# Altium schematic sheet 07 SD & QSPI & SENSOR.SchDoc
size 513 x 386 mm
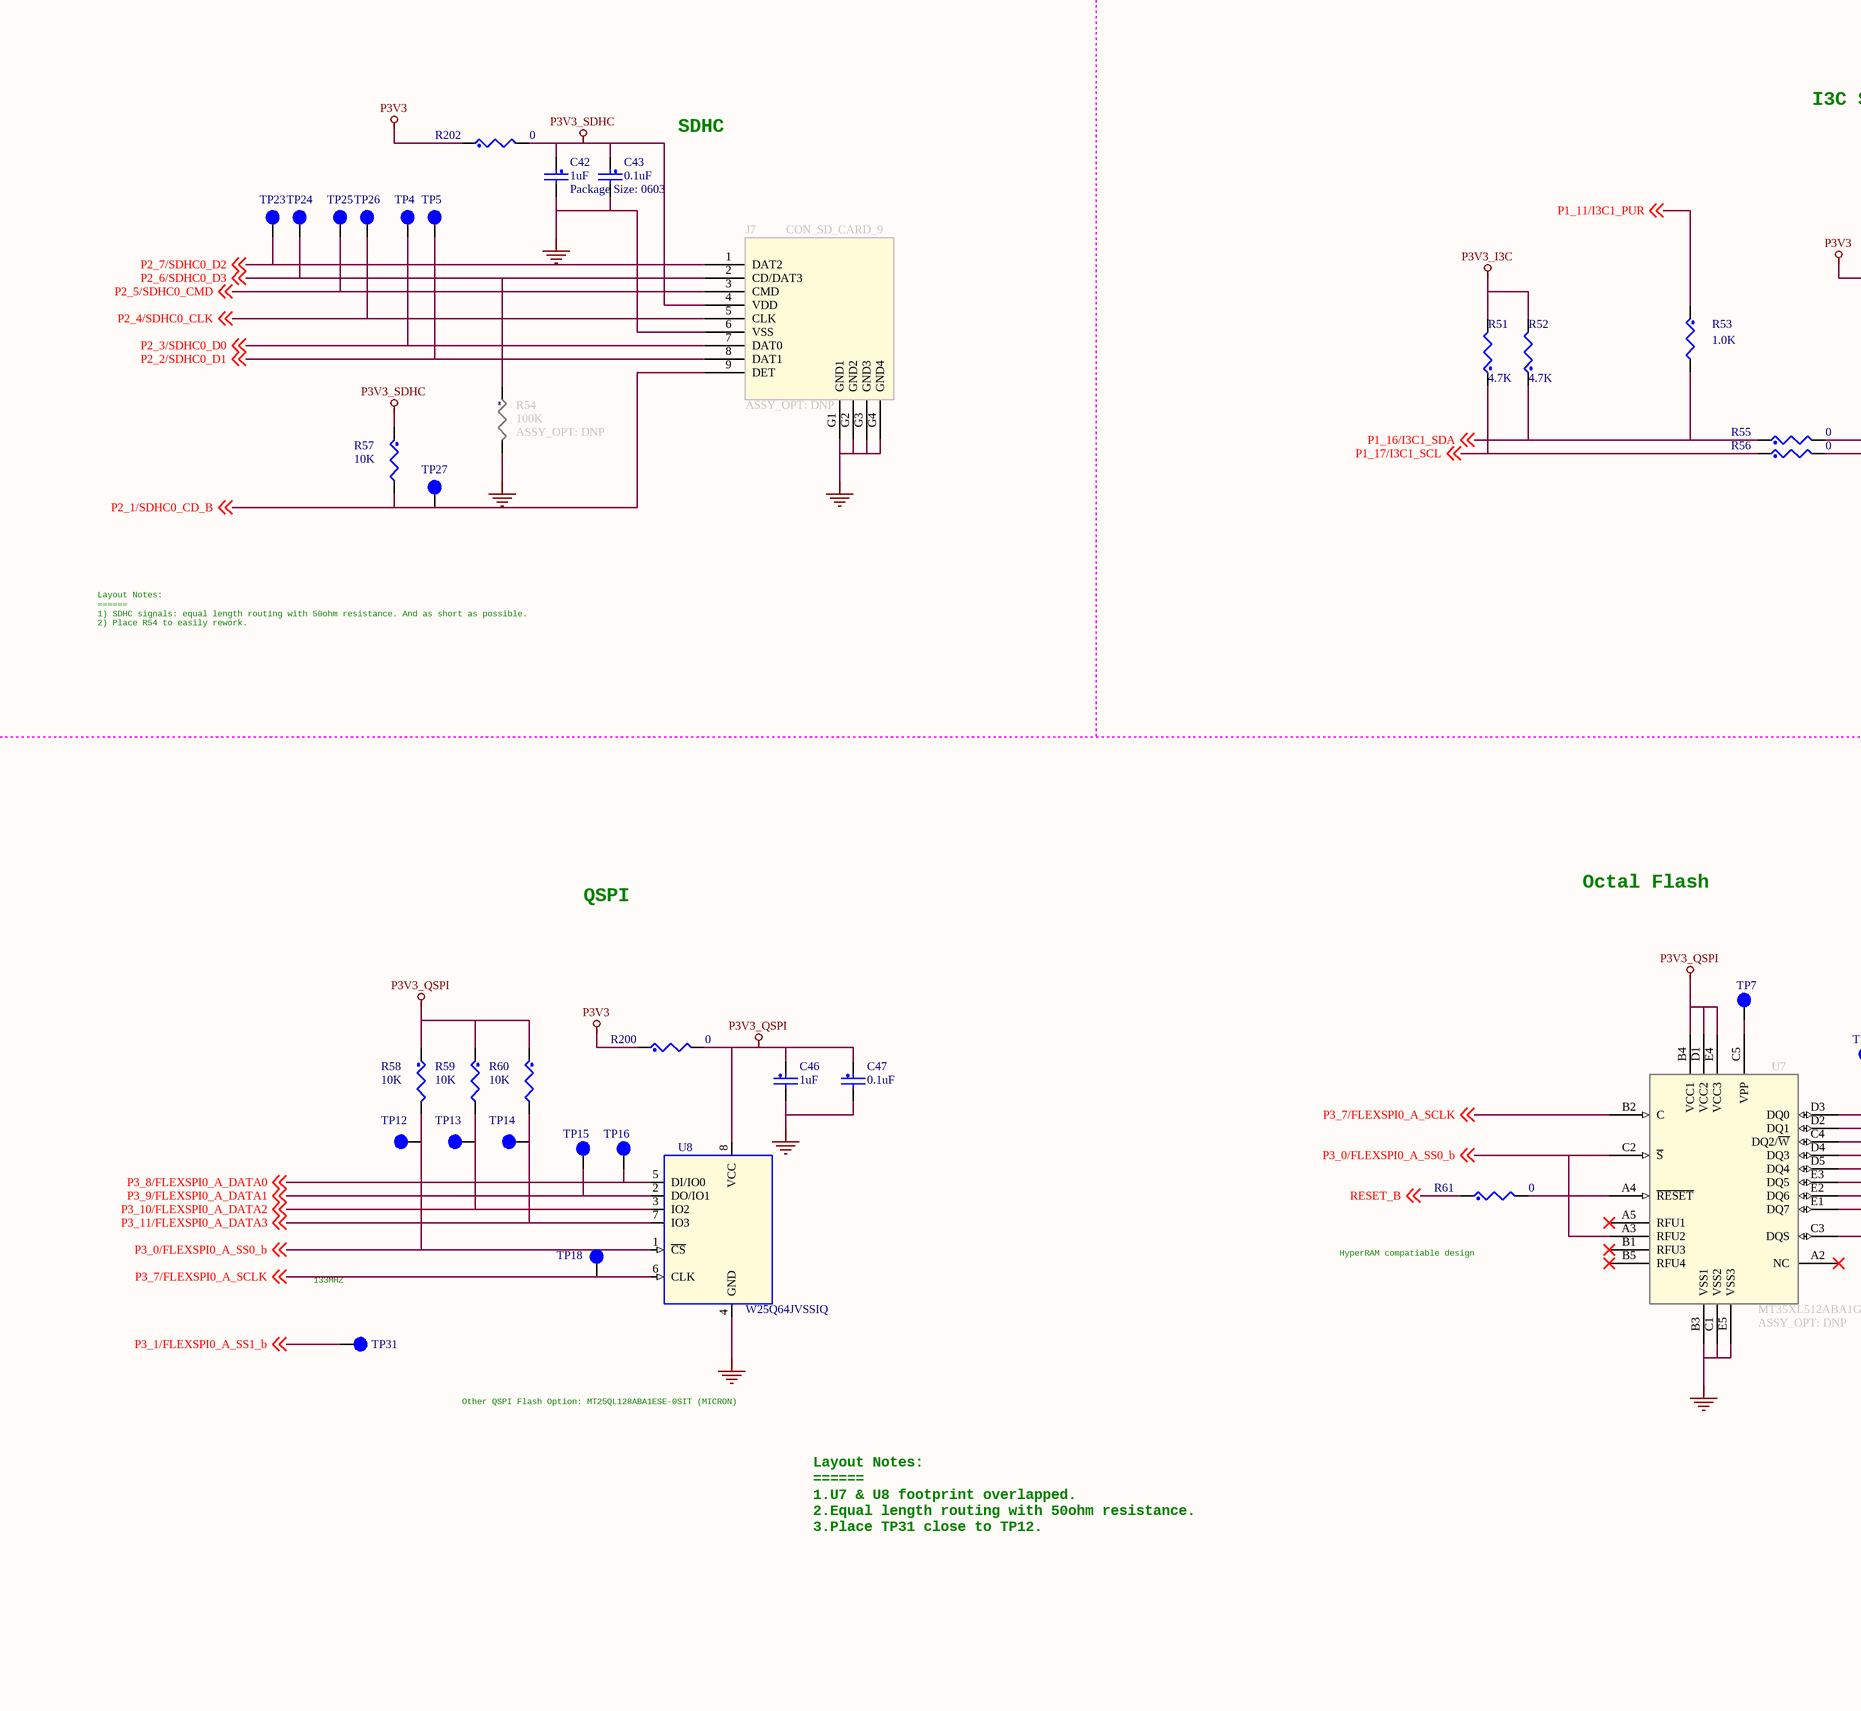
[diagram p0: 07 SD & QSPI & SENSOR.SchDoc, left]
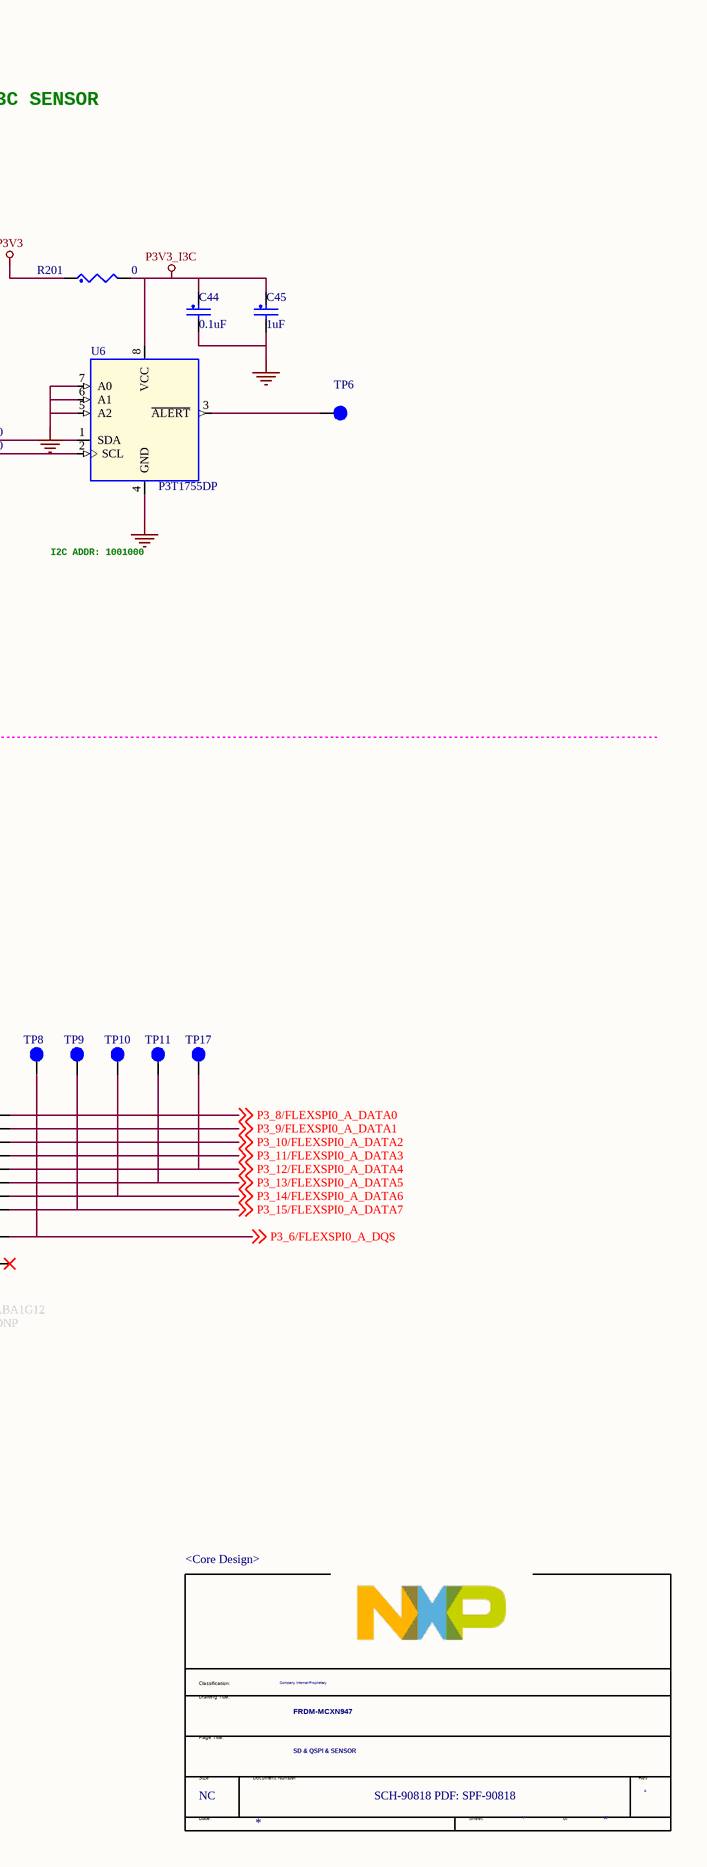
[diagram p1: 07 SD & QSPI & SENSOR.SchDoc, right]

## Parts
*  Doc: SCH-90818 PDF: SPF-90818  RevCode: A  Title: FRDM-MCXN947  Page Size: NC  Page Number: 7  Page Count: 13  PageTitle: SD & QSPI & SENSOR  Classification: Company Internal/Proprietary  Variant Name: <Core Design>  (hidden comment: TitleBlock_FS)  (graphical)
C42  1uF  Package Size: 0603  [CC0603_OV]
C43  0.1uF  [CC0402_25]
C44  0.1uF  [CC0402_25]
C45  1uF  [CC0603_OV]
C46  1uF  [CC0603_OV]
C47  0.1uF  [CC0402_25]
J7  CON_SD_CARD_9  ASSY_OPT: DNP  [con9_sdcard_1p1_15p05x14p75_sm]
R51  4.7K  [RC0402_25]
R52  4.7K  [RC0402_25]
R53  1.0K  [RC0402_25]
R54  100K  ASSY_OPT: DNP  [RC0402_25]
R55  0  [RC0603_OV]
R56  0  [RC0603_OV]
R57  10K  [RC0402_25]
R58  10K  [RC0402_25]
R59  10K  [RC0402_25]
R60  10K  [RC0402_25]
R61  0  [RC0603_OV]
R200  0  [RC0402_25]
R201  0  [RC0402_25]
R202  0  [RC0402_25]
TP4  TPAD_030  [TPAD_030]  (value not drawn)
TP5  TPAD_030  [TPAD_030]  (value not drawn)
TP6  TPAD_030  [TPAD_030]  (value not drawn)
TP7  TPAD_030  [TPAD_030]  (value not drawn)
TP8  TPAD_030  [TPAD_030]  (value not drawn)
TP9  TPAD_030  [TPAD_030]  (value not drawn)
TP10  TPAD_030  [TPAD_030]  (value not drawn)
TP11  TPAD_030  [TPAD_030]  (value not drawn)
TP12  TPAD_030  [TPAD_030]  (value not drawn)
TP13  TPAD_030  [TPAD_030]  (value not drawn)
TP14  TPAD_030  [TPAD_030]  (value not drawn)
TP15  TPAD_030  [TPAD_030]  (value not drawn)
TP16  TPAD_030  [TPAD_030]  (value not drawn)
TP17  TPAD_030  [TPAD_030]  (value not drawn)
TP18  TPAD_030  [TPAD_030]  (value not drawn)
TP23  TPAD_030  [TPAD_030]  (value not drawn)
TP24  TPAD_030  [TPAD_030]  (value not drawn)
TP25  TPAD_030  [TPAD_030]  (value not drawn)
TP26  TPAD_030  [TPAD_030]  (value not drawn)
TP27  TPAD_030  [TPAD_030]  (value not drawn)
TP31  TPAD_030  [TPAD_030]  (value not drawn)
U6  P3T1755DP  [tssop8_a]
U7  MT35XL512ABA1G12  ASSY_OPT: DNP  [pbga24_1_6x8mm]
U8  W25Q64JVSSIQ  [so8_w]

## Nets
GND: C42.2 C43.2 C44.2 C45.2 C46.2 C47.2 J7.6(VSS) J7.G1(GND1) J7.G2(GND2) J7.G3(GND3) J7.G4(GND4) R54.2 U6.4(GND) U6.5(A2) U6.6(A1) U6.7(A0) U7.B3(VSS1) U7.C1(VSS2) U7.E5(VSS3) U8.4(GND)
P3V3: R200.1 R201.1 R202.1
P3V3_I3C: C44.1 C45.1 R51.2 R52.2 R201.2 U6.8(VCC)
P3V3_QSPI: C46.1 C47.1 R58.1 R59.1 R60.1 R200.2 U7.B4(VCC1) U7.D1(VCC2) U7.E4(VCC3) U8.8(VCC)
P3V3_SDHC: C42.1 C43.1 J7.4(VDD) R57.1 R202.2
P1_11/I3C1_PUR: R53.1 ; off-sheet P1_11/I3C1_PUR
P1_16/I3C1_SDA: R52.1 R53.2 R55.1 ; off-sheet P1_16/I3C1_SDA
P1_17/I3C1_SCL: R51.1 R56.1 ; off-sheet P1_17/I3C1_SCL
P2_1/SDHC0_CD_B: J7.9(DET) R57.2 TP27.1(Pin1) ; off-sheet P2_1/SDHC0_CD_B
P2_2/SDHC0_D1: J7.8(DAT1) TP5.1(Pin1) ; off-sheet P2_2/SDHC0_D1
P2_3/SDHC0_D0: J7.7(DAT0) TP4.1(Pin1) ; off-sheet P2_3/SDHC0_D0
P2_4/SDHC0_CLK: J7.5(CLK) TP26.1(Pin1) ; off-sheet P2_4/SDHC0_CLK
P2_5/SDHC0_CMD: J7.3(CMD) TP25.1(Pin1) ; off-sheet P2_5/SDHC0_CMD
P2_6/SDHC0_D3: J7.2(CD/DAT3) R54.1 TP24.1(Pin1) ; off-sheet P2_6/SDHC0_D3
P2_7/SDHC0_D2: J7.1(DAT2) TP23.1(Pin1) ; off-sheet P2_7/SDHC0_D2
P3_0/FLEXSPI0_A_SS0_b: R58.2 TP12.1(Pin1) U7.A3(RFU2) U7.C2(~{S}) U8.1(~{CS}) ; off-sheet P3_0/FLEXSPI0_A_SS0_b
P3_1/FLEXSPI0_A_SS1_b: TP31.1(Pin1) ; off-sheet P3_1/FLEXSPI0_A_SS1_b
P3_6/FLEXSPI0_A_DQS: TP8.1(Pin1) U7.C3(DQS) ; off-sheet P3_6/FLEXSPI0_A_DQS
P3_7/FLEXSPI0_A_SCLK: TP18.1(Pin1) U7.B2(C) U8.6(CLK) ; off-sheet P3_7/FLEXSPI0_A_SCLK
P3_8/FLEXSPI0_A_DATA0: TP16.1(Pin1) U7.D3(DQ0) U8.5(DI/IO0) ; off-sheet P3_8/FLEXSPI0_A_DATA0
P3_9/FLEXSPI0_A_DATA1: TP15.1(Pin1) U7.D2(DQ1) U8.2(DO/IO1) ; off-sheet P3_9/FLEXSPI0_A_DATA1
P3_10/FLEXSPI0_A_DATA2: R59.2 TP13.1(Pin1) U7.C4(DQ2/~{W}) U8.3(IO2) ; off-sheet P3_10/FLEXSPI0_A_DATA2
P3_11/FLEXSPI0_A_DATA3: R60.2 TP14.1(Pin1) U7.D4(DQ3) U8.7(IO3) ; off-sheet P3_11/FLEXSPI0_A_DATA3
P3_12/FLEXSPI0_A_DATA4: TP17.1(Pin1) U7.D5(DQ4) ; off-sheet P3_12/FLEXSPI0_A_DATA4
P3_13/FLEXSPI0_A_DATA5: TP11.1(Pin1) U7.E3(DQ5) ; off-sheet P3_13/FLEXSPI0_A_DATA5
P3_14/FLEXSPI0_A_DATA6: TP10.1(Pin1) U7.E2(DQ6) ; off-sheet P3_14/FLEXSPI0_A_DATA6
P3_15/FLEXSPI0_A_DATA7: TP9.1(Pin1) U7.E1(DQ7) ; off-sheet P3_15/FLEXSPI0_A_DATA7
RESET_B: R61.1 ; off-sheet RESET_B
NetR55_2: R55.2 U6.1(SDA)
NetR56_2: R56.2 U6.2(SCL)
NetR61_2: R61.2 U7.A4(~{RESET})
NetTP6_1: TP6.1(Pin1) U6.3(~{ALERT})
NetTP7_1: TP7.1(Pin1) U7.C5(VPP)

Not connected (* = marked no-connect by the designer): U7 A2(NC)* A5(RFU1)* B1(RFU3)* B5(RFU4)*

## Notes on the sheet
- I3C SENSOR
- SDHC
- Layout Notes:
  ======
  1) SDHC signals: equal length routing with 50ohm resistance. And as short as possible.
  2) Place R54 to easily rework.
- I2C ADDR: 1001000
- QSPI
- Octal Flash
- HyperRAM compatiable design
- 133MHZ
- Other QSPI Flash Option: MT25QL128ABA1ESE-0SIT (MICRON)
- Layout Notes:
  ======
  1.U7 & U8 footprint overlapped.
  2.Equal length routing with 50ohm resistance.
  3.Place TP31 close to TP12.
- (in symbol TitleBlock_FS) Classification:; Drawing Title:; Page Title:; Size; Document Number; Rev; Date:; Sheet; of

## Library data of the parts
* = TitleBlock_FS: Classification: Public, Company Internal/Proprietary, Company Confidential,  Company Secret; OrgAddr2: Austin, TX 78735-8598; OrgAddr1: 6501 William Cannon Drive West; OrgName: NXP Semiconductors; Page Create Date: March  8, 1995; Page Modify Date: *
C42 C45 = CAP_NP: CAP CER 1uF 16V 20% X5R 0603; CLASS: DISCRETE; MFG_PN01: 885012106017; MFG_NAME01: WURTH ELEKTRONIK; Temp Range: -55C TO 85C; CAD_APPROVED: Yes; FPLIST: CC0603_OV,CC0603,0603_CC; AGILE_PN: 150-81891; PCB Footprint: CC0603_OV; 3D_Mechanical_Footprint_File: http://fcl.am.freescale.net/ALLEGRO/step/cc0603_ov.STEP; VOLTAGE: 16V; ROHS: Yes; Rated Voltage: 16V; Tolerance: 20%; Package Type: WCAP-CSGP_0603; HEIGHT: 0.87MM
  C45: Package Size: 0603
C43 C47 = CAP_NP: CAP CER 0.1UF 16V 10% X7R 0402; CLASS: DISCRETE; FPLIST: CC0402_25,CC0402_HD,0402_CC,CAPC0402_L,cc0402_lamp3; CAD_APPROVED: Yes; MFG_PN01: CL05B104KO5NNNC; MFG_NAME01: Samsung Electro-Mechanics; AGILE_PN: 150-75182; SIGNAL_MODEL: DEFAULT_CAPACITOR_100000pF_2_1; Temp Range: -55C to +125C; PCB Footprint: CC0402_25; VOLTAGE: 16V; TOL: 10%; HEIGHT: 0.635MM; ROHS: Yes; Tolerance: 10%; Rated Voltage: 16V; 3D_Mechanical_Footprint_File: http://fcl.am.freescale.net/ALLEGRO/step/cc0402_25.STEP
C44 = CAP_NP: CAP CER 0.1UF 16V 10% X7R 0402; CLASS: DISCRETE; MFG_PN01: CL05B104KO5NNNC; MFG_NAME01: Samsung Electro-Mechanics; Temp Range: -55C to +125C; CAD_APPROVED: Yes; FPLIST: CC0402_25,CC0402_HD,0402_CC,CAPC0402_L,cc0402_lamp3; AGILE_PN: 150-75182; PCB Footprint: CC0402_25; 3D_Mechanical_Footprint_File: http://fcl.am.freescale.net/ALLEGRO/step/cc0402_25.STEP; VOLTAGE: 16V; ROHS: Yes; Rated Voltage: 16V; Tolerance: 10%; HEIGHT: 0.635MM
C46 = CAP_NP: CAP CER 1uF 16V 20% X5R 0603; CLASS: DISCRETE; AGILE_PN: 150-81891; FPLIST: CC0603_OV,CC0603,0603_CC; CAD_APPROVED: Yes; Temp Range: -55C TO 85C; MFG_NAME01: WURTH ELEKTRONIK; MFG_PN01: 885012106017; PCB Footprint: CC0603_OV; Package Size: 0603; HEIGHT: 0.87MM; Package Type: WCAP-CSGP_0603; Tolerance: 20%; Rated Voltage: 16V; ROHS: Yes; VOLTAGE: 16V; 3D_Mechanical_Footprint_File: http://fcl.am.freescale.net/ALLEGRO/step/cc0603_ov.STEP
J7 = CON_MICROSD_9P_4G: CON 9 MICRO SD CARD SKT SMT 1.1MM SP AU 57H; CLASS: IO; AGILE_PN: 211-83462; Contact Voltage: 30VAC, 30VDC; CAD_APPROVED: Yes; Temp Range: -25¡ãC to +85¡ãC; MFG_NAME01: GCT; MFG_PN01: MEM2075-00-140-01-A; PCB Footprint: con9_sdcard_1p1_15p05x14p75_sm; HEIGHT: 1.45 mm; Package Type: SMD/SMT; 3D_Mechanical_Footprint_File: http://fcl.am.freescale.net/ALLEGRO/step/con9_sdcard_1p1_15p05x14p75_sm.STEP
R51 = RES: RES MF 4.7K 1/16W 5% 0402; CLASS: DISCRETE; MFG_PN01: CR0402-JW-472GLF; MFG_NAME01: BOURNS; CAD_APPROVED: Yes; FPLIST: RC0402_25,RC0402_HD,0402_CC,RC0402_X2; AGILE_PN: 470-75626; Pkg: 0402; PCB Footprint: RC0402_25; ROHS: Yes; Tolerance: 5%; HEIGHT: 0.41mm
R52 = RES: RES MF 4.7K 1/16W 5% 0402; CLASS: DISCRETE; Pkg: 0402; AGILE_PN: 470-75626; FPLIST: RC0402_25,RC0402_HD,0402_CC,RC0402_X2; CAD_APPROVED: Yes; MFG_NAME01: BOURNS; MFG_PN01: CR0402-JW-472GLF; PCB Footprint: RC0402_25; HEIGHT: 0.41mm; Tolerance: 5%; ROHS: Yes
R53 = RES: RES MF 1.0K 1/16W 1% 0402; CLASS: DISCRETE; MFG_PN01: CR0402-FX-1001GLF; MFG_NAME01: BOURNS; CAD_APPROVED: Yes; FPLIST: RC0402_25,RC0402_HD,RC0402_X2,0402_CC; AGILE_PN: 470-76037; ROHS: Yes; Tolerance: 1%; HEIGHT: 0.4MM; PCB Footprint: RC0402_25
R54 = RES: RES MF 100K 1/16W 1% 0402; CLASS: DISCRETE; AGILE_PN: 470-76240; FPLIST: RC0402_25,RC0402_HD,0402_CC; CAD_APPROVED: Yes; MFG_NAME01: BOURNS; MFG_PN01: CR0402-FX-1003GLF; HEIGHT: 0.4MM; Tolerance: 1%; ROHS: Yes; PCB Footprint: RC0402_25
R55 R56 = RES: RES MF ZERO OHM 1/10W -- 0603; CLASS: DISCRETE; AGILE_PN: 470-80866; FPLIST: RC0603_OV,RC0603,R603-X2,r603-x2_b,0603_CC,IND_0603HP_NSP,CC0603_OV_NSP; CAD_APPROVED: Yes; Temp Range: ¨C55 ¡ãC to +155 ¡ãC; MFG_NAME01: YAGEO AMERICA; MFG_PN01: RC0603FR-070RL; HEIGHT: 0.6MM; ROHS: Yes; PCB Footprint: RC0603_OV
R57 = RES: RES MF 10K 1/16W 1% 0402; CLASS: DISCRETE; MFG_PN01: NRCL04F1002TRF; MFG_NAME01: NIC COMPONENTS CORP; CAD_APPROVED: Yes; FPLIST: RC0402_25,RC0402_HD,0402_CC,RC0402_X2; AGILE_PN: 470-80452; PCB Footprint: RC0402_25; ROHS: Yes; Tolerance: 1%; HEIGHT: 0.40 MM
R58-R60 = RES: RES MF 10K 1/16W 1% 0402; CLASS: DISCRETE; AGILE_PN: 470-80452; MFG_NAME01: NIC COMPONENTS CORP; MFG_PN01: NRCL04F1002TRF; CAD_APPROVED: Yes; FPLIST: RC0402_25,RC0402_HD,0402_CC,RC0402_X2; SIGNAL_MODEL: DEFAULT_RESISTOR_10000OHM_2_1; Temp_Range: –55 °C to +155 °C; PCB Footprint: RC0402_25; Tolerance: 1%; ROHS: Yes; TOL: 1%; HEIGHT: 0.40 MM
R61 = RES: RES MF ZERO OHM 1/10W -- 0603; CLASS: DISCRETE; MFG_PN01: RC0603FR-070RL; MFG_NAME01: YAGEO AMERICA; Temp Range: ¨C55 ¡ãC to +155 ¡ãC; CAD_APPROVED: Yes; FPLIST: RC0603_OV,RC0603,R603-X2,r603-x2_b,0603_CC,IND_0603HP_NSP,CC0603_OV_NSP; AGILE_PN: 470-80866; ROHS: Yes; HEIGHT: 0.6MM; PCB Footprint: RC0603_OV
R200-R202 = RES: RES MF ZERO OHM 1/16W 5% 0402; CLASS: DISCRETE; AGILE_PN: 470-75394; FPLIST: RC0402_25,RC0402_HD,RC0402_X2,0402_CC,rc0402_lamp3; CAD_APPROVED: Yes; MFG_NAME01: BOURNS; MFG_PN01: CR0402-J/-000GLF; PCB Footprint: RC0402_25; HEIGHT: 0.45 MM; Tolerance: 5%; ROHS: Yes
TP4 TP5 TP9 TP14 TP16 TP18 TP25 TP26 TP31 = TESTLOOP: TEST POINT PAD 30MIL DIA SMT, NO PART TO ORDER; CLASS: IO; AGILE_PN: 211-76642; MFG_NAME01: NOTACOMPONENT; CAD_APPROVED: Yes; PCB Footprint: TPAD_030; 3D_Mechanical_Footprint_File: http://fcl.am.freescale.net/ALLEGRO/step/tpad_030.STEP; MFG_PN01: NOTACOMPONENT; ROHS: Yes; HEIGHT: 0.1MM
TP6-TP8 TP10-TP13 TP15 TP17 TP23 TP24 TP27 = TESTLOOP: TEST POINT PAD 30MIL DIA SMT, NO PART TO ORDER; CLASS: IO; CAD_APPROVED: Yes; MFG_PN01: NOTACOMPONENT; AGILE_PN: 211-76642; PCB Footprint: TPAD_030; 3D_Mechanical_Footprint_File: http://fcl.am.freescale.net/ALLEGRO/step/tpad_030.STEP; HEIGHT: 0.1MM; ROHS: Yes; MFG_NAME01: NOTACOMPONENT
U6 = P3T2175DP_TSSOP8: IC DIG TEMP SENSOR I3C/I2C 1.4-3.6V TSSOP8; AGILE_PN: TMP-CIP-12137; CAD_APPROVED: Yes; PRE_APN: 312-83689; Temp Range: -40¡ãC to +125¡ãC; MFG_NAME01: NXP SEMICONDUCTORS; MFG_PN01: P3T1755DPJ; CLASS: IC; Package Size: 3 x 3 x 1.1 mm; HEIGHT: 1.1MM; Supply Voltage: 1.4-3.6V; ROHS: Yes; VOLTAGE: 1.4-3.6V; 3D_Mechanical_Footprint_File: http://fcl.am.freescale.net/ALLEGRO/step/tssop8_a.STEP; PCB Footprint: tssop8_a
U7 = MT35XL512ABA1G12: IC MEM FLASH SERIAL NOR 512Mb 2.7-3.6V AEC-Q100 T-PBGA24; AGILE_PN: 342-00726; CAD_APPROVED: Yes; Temp Range: -40C to +105C; MFG_NAME01: MICRON; MFG_PN01: MT35XL512ABA1G12-0AATES; CLASS: IC; HEIGHT: 1.2MM; ROHS: Yes; VOLTAGE: 2.7-3.6V; PCB Footprint: pbga24_1_6x8mm
U8 = W25Q64JV_SOIC_8P_B: IC MEM SERIAL FLASH DUAL/QUAD SPI 64MBIT 2.7-3.6V SOIC8; AGILE_PN: 342-00710; CAD_APPROVED: Yes; Temp Range: ¨C40C to +85C; MFG_NAME01: WINBOND ELECTRONICS CORP; CLASS: IC; HEIGHT: 2.16MM; ROHS: Yes; VOLTAGE: 2.7-3.6V; MFG_PN01: W25Q64JVSSIQ; PCB Footprint: so8_w